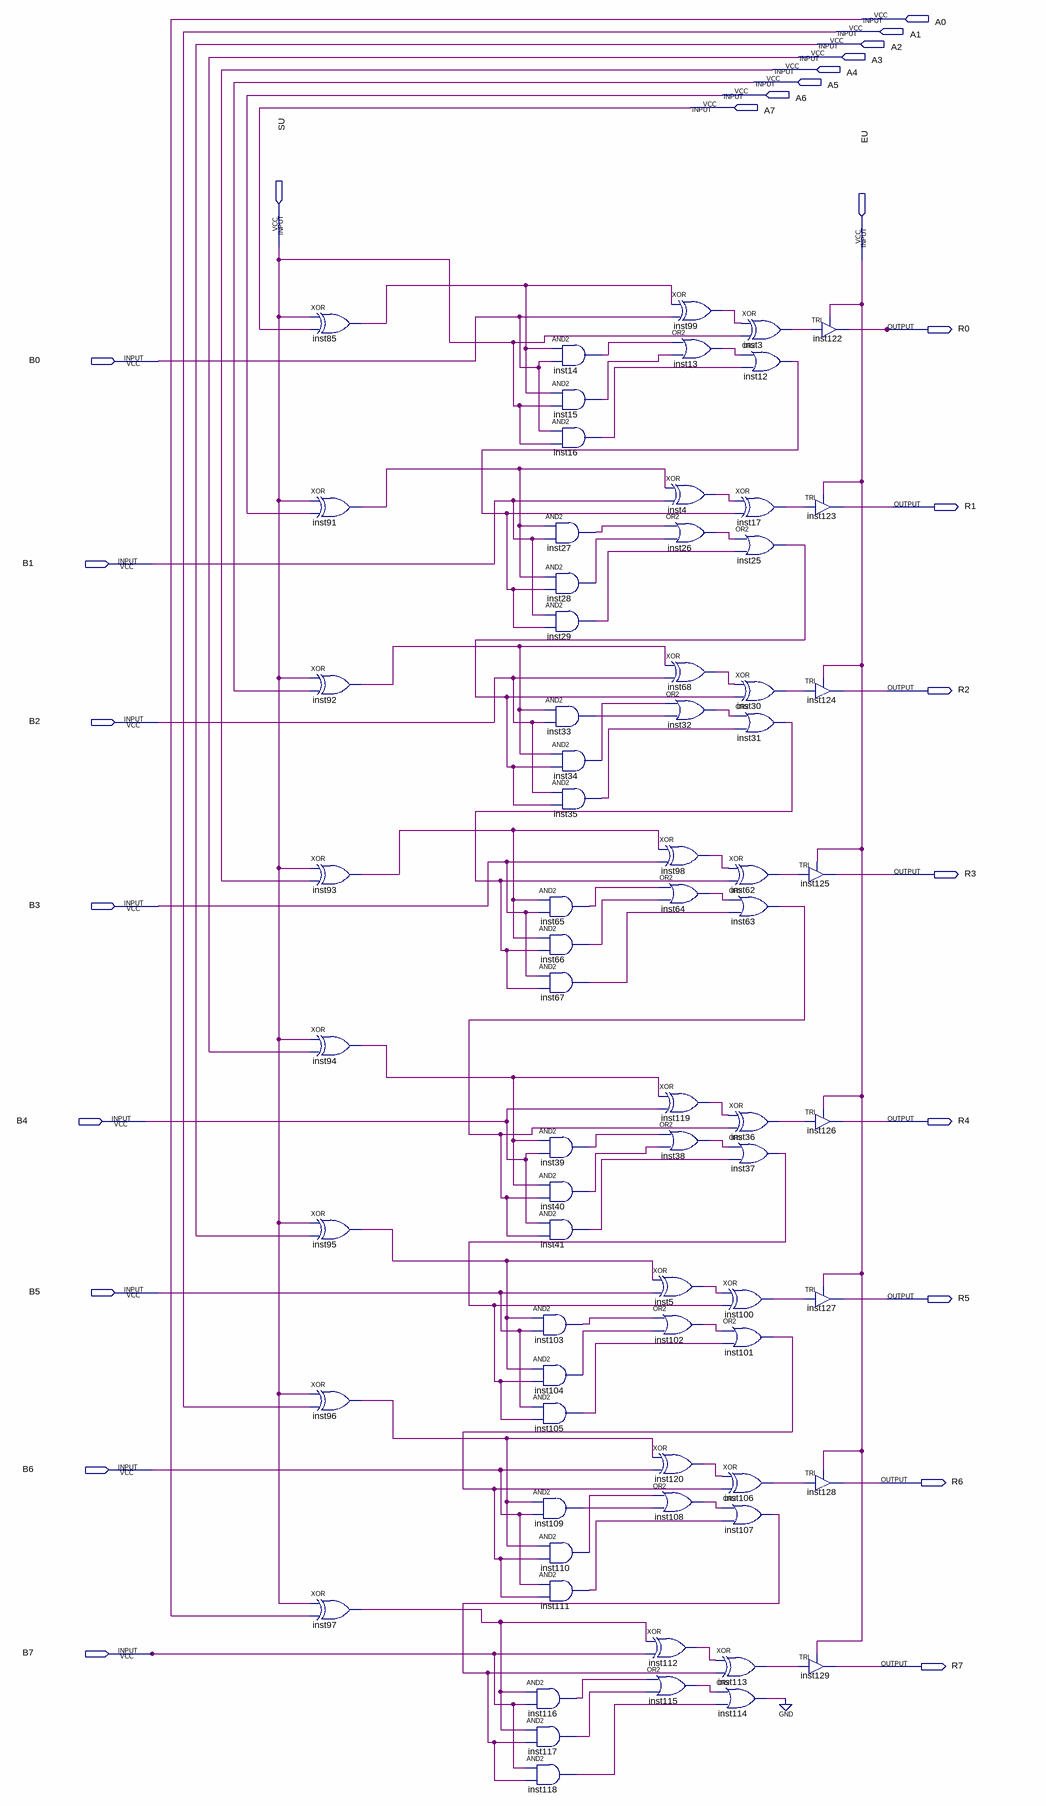
[diagram p0: schematic sheet]
// Quartus schematic Adder_Subtractor_Acumulator.bdf as structural Verilog: 72 symbols, 26 pins
module Adder_Subtractor_Acumulator (
  input  A0,
  input  A1,
  input  A2,
  input  A3,
  input  A4,
  input  A5,
  input  A6,
  input  A7,
  input  SU,
  input  EU,
  input  B0,
  input  B1,
  input  B2,
  input  B3,
  input  B4,
  input  B5,
  input  B6,
  input  B7,
  output R0,
  output R1,
  output R2,
  output R3,
  output R4,
  output R5,
  output R6,
  output R7
);

  wire inst3_out, inst4_out, inst5_out, inst12_out, inst13_out, inst14_out, inst15_out, inst16_out,
       inst17_out, inst25_out, inst26_out, inst27_out, inst28_out, inst29_out, inst30_out, inst31_out,
       inst32_out, inst33_out, inst34_out, inst35_out, inst36_out, inst37_out, inst38_out, inst39_out,
       inst40_out, inst41_out, inst62_out, inst63_out, inst64_out, inst65_out, inst66_out, inst67_out,
       inst68_out, inst85_out, inst91_out, inst92_out, inst93_out, inst94_out, inst95_out, inst96_out,
       inst97_out, inst98_out, inst99_out, inst100_out, inst101_out, inst102_out, inst103_out, inst104_out,
       inst105_out, inst106_out, inst107_out, inst108_out, inst109_out, inst110_out, inst111_out,
       inst112_out, inst113_out, inst114_out, inst115_out, inst116_out, inst117_out, inst118_out,
       inst119_out, inst120_out;

  xor inst85 (inst85_out, SU, A7);
  xor inst91 (inst91_out, SU, A6);
  xor inst92 (inst92_out, SU, A5);
  xor inst93 (inst93_out, SU, A4);
  xor inst94 (inst94_out, SU, A3);
  xor inst95 (inst95_out, SU, A2);
  xor inst96 (inst96_out, SU, A1);
  xor inst97 (inst97_out, SU, A0);
  and inst14 (inst14_out, inst85_out, B0);
  and inst15 (inst15_out, inst85_out, SU);
  and inst16 (inst16_out, B0, SU);
  and inst27 (inst27_out, inst91_out, B1);
  and inst28 (inst28_out, inst91_out, inst12_out);
  and inst29 (inst29_out, B1, inst12_out);
  and inst33 (inst33_out, inst92_out, B2);
  and inst34 (inst34_out, inst92_out, inst25_out);
  and inst35 (inst35_out, B2, inst25_out);
  and inst65 (inst65_out, inst93_out, B3);
  and inst66 (inst66_out, inst93_out, inst31_out);
  and inst67 (inst67_out, B3, inst31_out);
  and inst39 (inst39_out, inst94_out, B4);
  and inst40 (inst40_out, inst94_out, inst63_out);
  and inst41 (inst41_out, B4, inst63_out);
  and inst103 (inst103_out, inst95_out, B5);
  and inst104 (inst104_out, inst95_out, inst37_out);
  and inst105 (inst105_out, B5, inst37_out);
  and inst109 (inst109_out, inst96_out, B6);
  and inst110 (inst110_out, inst96_out, inst101_out);
  and inst111 (inst111_out, B6, inst101_out);
  and inst116 (inst116_out, inst97_out, B7);
  and inst117 (inst117_out, inst97_out, inst107_out);
  and inst118 (inst118_out, B7, inst107_out);
  xor inst99 (inst99_out, inst85_out, B0);
  or inst13 (inst13_out, inst14_out, inst15_out);
  xor inst4 (inst4_out, inst91_out, B1);
  or inst26 (inst26_out, inst27_out, inst28_out);
  xor inst68 (inst68_out, inst92_out, B2);
  or inst32 (inst32_out, inst34_out, inst33_out);
  xor inst98 (inst98_out, inst93_out, B3);
  or inst64 (inst64_out, inst65_out, inst66_out);
  xor inst119 (inst119_out, inst94_out, B4);
  or inst38 (inst38_out, inst39_out, inst40_out);
  xor inst5 (inst5_out, inst95_out, B5);
  or inst102 (inst102_out, inst103_out, inst104_out);
  xor inst120 (inst120_out, inst96_out, B6);
  or inst108 (inst108_out, inst110_out, inst109_out);
  xor inst112 (inst112_out, inst97_out, B7);
  or inst115 (inst115_out, inst116_out, inst117_out);
  xor inst100 (inst100_out, inst5_out, inst37_out);
  or inst101 (inst101_out, inst102_out, inst105_out);
  xor inst106 (inst106_out, inst120_out, inst101_out);
  or inst107 (inst107_out, inst108_out, inst111_out);
  xor inst113 (inst113_out, inst112_out, inst107_out);
  or inst114 (inst114_out, inst115_out, inst118_out);
  xor inst3 (inst3_out, inst99_out, SU);
  or inst12 (inst12_out, inst13_out, inst16_out);
  xor inst17 (inst17_out, inst4_out, inst12_out);
  or inst25 (inst25_out, inst26_out, inst29_out);
  xor inst30 (inst30_out, inst68_out, inst25_out);
  or inst31 (inst31_out, inst32_out, inst35_out);
  xor inst62 (inst62_out, inst98_out, inst31_out);
  or inst63 (inst63_out, inst64_out, inst67_out);
  xor inst36 (inst36_out, inst119_out, inst63_out);
  or inst37 (inst37_out, inst38_out, inst41_out);
  TRI inst122 (.IN(inst3_out), .OE(EU), .OUT(R0));
  TRI inst123 (.IN(inst17_out), .OE(EU), .OUT(R1));
  TRI inst124 (.IN(inst30_out), .OE(EU), .OUT(R2));
  TRI inst125 (.IN(inst62_out), .OE(EU), .OUT(R3));
  TRI inst126 (.IN(inst36_out), .OE(EU), .OUT(R4));
  TRI inst127 (.IN(inst100_out), .OE(EU), .OUT(R5));
  TRI inst128 (.IN(inst106_out), .OE(EU), .OUT(R6));
  TRI inst129 (.IN(inst113_out), .OE(EU), .OUT(R7));
  // also tied to GND on the sheet: inst114_out
endmodule
